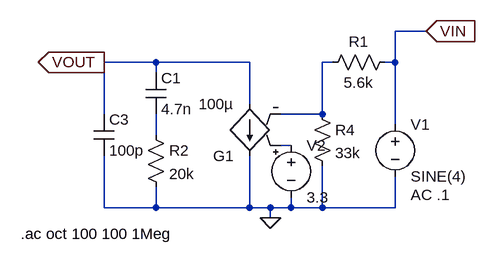
[diagram p0: schematic Buck_converter_type2_comp.asc]
Buck_converter_type2_comp.asc, the LTspice schematic file:
Version 4
SHEET 1 880 680
WIRE 368 48 320 48
WIRE -48 96 -128 96
WIRE 96 96 -48 96
WIRE 224 96 208 96
WIRE 320 96 320 48
WIRE 320 96 304 96
WIRE -48 112 -48 96
WIRE 96 160 96 96
WIRE -128 176 -128 96
WIRE 208 176 208 96
WIRE 208 176 144 176
WIRE 320 192 320 96
WIRE -48 208 -48 176
WIRE 160 224 144 224
WIRE -128 320 -128 240
WIRE -48 320 -48 288
WIRE -48 320 -128 320
WIRE 96 320 96 240
WIRE 96 320 -48 320
WIRE 128 320 96 320
WIRE 160 320 160 304
WIRE 160 320 128 320
WIRE 208 320 208 256
WIRE 208 320 160 320
WIRE 320 320 320 272
WIRE 320 320 208 320
WIRE 128 336 128 320
FLAG 128 336 0
FLAG 368 48 VIN
IOPIN 368 48 In
FLAG -128 96 VOUT
IOPIN -128 96 Out
SYMBOL res -64 192 R0
SYMATTR InstName R2
SYMATTR Value 20k
SYMBOL cap -64 112 R0
SYMATTR InstName C1
SYMATTR Value 4.7n
SYMBOL cap -144 176 R0
SYMATTR InstName C3
SYMATTR Value 100p
SYMBOL voltage 320 176 R0
WINDOW 123 24 124 Left 2
WINDOW 39 0 0 Left 2
SYMATTR Value2 AC .1
SYMATTR InstName V1
SYMATTR Value SINE(4)
SYMBOL res 320 80 R90
WINDOW 0 0 56 VBottom 2
WINDOW 3 32 56 VTop 2
SYMATTR InstName R1
SYMATTR Value 5.6k
SYMBOL g 96 256 R180
SYMATTR InstName G1
SYMATTR Value 100µ
SYMBOL res 192 160 R0
SYMATTR InstName R4
SYMATTR Value 33k
SYMBOL voltage 160 208 R0
WINDOW 123 0 0 Left 2
WINDOW 39 0 0 Left 2
SYMATTR InstName V2
SYMATTR Value 3.3
TEXT -256 360 Left 2 !.ac oct 100 100 1Meg

The netlist it stands for:
* Buck_converter_type2_comp.asc
R2 N002 0 20k
C1 VOUT N002 4.7n
C3 VOUT 0 100p
V1 VIN 0 SINE(4) AC .1
R1 VIN N001 5.6k
G1 VOUT 0 N003 N001 100µ
R4 N001 0 33k
V2 N003 0 3.3
.ac oct 100 100 1Meg
.backanno
.end